# EAGLE design backplane rev 2 (EAGLE 9.6.2)
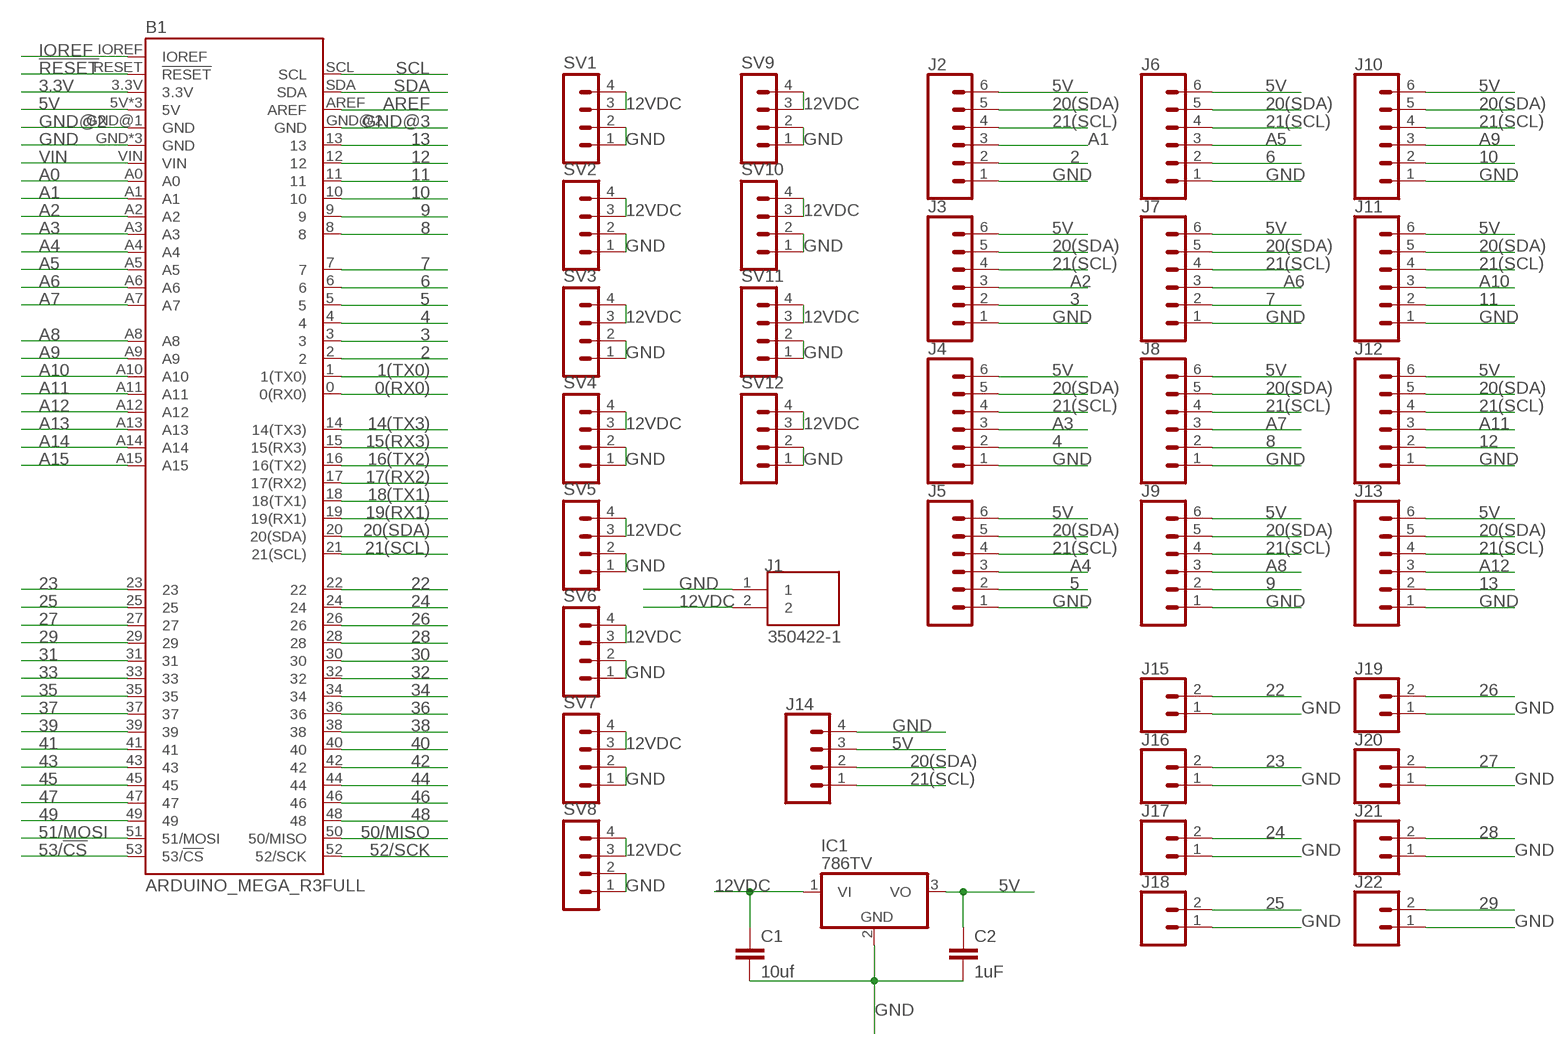
[diagram p0: schematic, sheet 1]

## Parts
B1  ARDUINO_MEGA_R3FULL  [ARDUINO_MEGA_NO_SILK]
C1  10uf  C2,5-3  [C2.5-3]
C2  1uF  C2,5-3  [C2.5-3]
IC1  786TV  [TO220V]
J1  350422-1  [POWER-PIN]
J2  CONN_06NO_SILK_FEMALE_PTH  [1X06_NO_SILK]
J3  CONN_06NO_SILK_FEMALE_PTH  [1X06_NO_SILK]
J4  CONN_06NO_SILK_FEMALE_PTH  [1X06_NO_SILK]
J5  CONN_06NO_SILK_FEMALE_PTH  [1X06_NO_SILK]
J6  CONN_06NO_SILK_FEMALE_PTH  [1X06_NO_SILK]
J7  CONN_06NO_SILK_FEMALE_PTH  [1X06_NO_SILK]
J8  CONN_06NO_SILK_FEMALE_PTH  [1X06_NO_SILK]
J9  CONN_06NO_SILK_FEMALE_PTH  [1X06_NO_SILK]
J10  CONN_06NO_SILK_FEMALE_PTH  [1X06_NO_SILK]
J11  CONN_06NO_SILK_FEMALE_PTH  [1X06_NO_SILK]
J12  CONN_06NO_SILK_FEMALE_PTH  [1X06_NO_SILK]
J13  CONN_06NO_SILK_FEMALE_PTH  [1X06_NO_SILK]
J14  CONN_04PTH  [1X04]
J15  CONN_02  [1X02]
J16  CONN_02  [1X02]
J17  CONN_02  [1X02]
J18  CONN_02  [1X02]
J19  CONN_02  [1X02]
J20  CONN_02  [1X02]
J21  CONN_02  [1X02]
J22  CONN_02  [1X02]
SV1  MA04-1  [MA04-1]
SV2  MA04-1  [MA04-1]
SV3  MA04-1  [MA04-1]
SV4  MA04-1  [MA04-1]
SV5  MA04-1  [MA04-1]
SV6  MA04-1  [MA04-1]
SV7  MA04-1  [MA04-1]
SV8  MA04-1  [MA04-1]
SV9  MA04-1  [MA04-1]
SV10  MA04-1  [MA04-1]
SV11  MA04-1  [MA04-1]
SV12  MA04-1  [MA04-1]

## Nets
0(RX0): B1.0(0(RX0))
1(TX0): B1.1(1(TX0))
2: B1.2 J2.2
3: B1.3 J3.2
3.3V: B1.3.3V
4: B1.4 J4.2
5: B1.5 J5.2
5V: B1.5V B1.5V@1(5V) B1.5V@2(5V) C2.1 IC1.3(VO) J2.6 J3.6 J4.6 J5.6 J6.6 J7.6 J8.6 J9.6 J10.6 J11.6 J12.6 J13.6 J14.3
6: B1.6 J6.2
7: B1.7 J7.2
8: B1.8 J8.2
9: B1.9 J9.2
10: B1.10 J10.2
11: B1.11 J11.2
12: B1.12 J12.2
12VDC: C1.1 IC1.1(VI) J1.2 SV1.3 SV1.4 SV2.3 SV2.4 SV3.3 SV3.4 SV4.3 SV4.4 SV5.3 SV5.4 SV6.3 SV6.4 SV7.3 SV7.4 SV8.3 SV8.4 SV9.3 SV9.4 SV10.3 SV10.4 SV11.3 SV11.4 SV12.3 SV12.4
13: B1.13 J13.2
14(TX3): B1.14(14(TX3))
15(RX3): B1.15(15(RX3))
16(TX2): B1.16(16(TX2))
17(RX2): B1.17(17(RX2))
18(TX1): B1.18(18(TX1))
19(RX1): B1.19(19(RX1))
20(SDA): B1.20(20(SDA)) J2.5 J3.5 J4.5 J5.5 J6.5 J7.5 J8.5 J9.5 J10.5 J11.5 J12.5 J13.5 J14.2
21(SCL): B1.21(21(SCL)) J2.4 J3.4 J4.4 J5.4 J6.4 J7.4 J8.4 J9.4 J10.4 J11.4 J12.4 J13.4 J14.1
22: B1.22 J15.2
23: B1.23 J16.2
24: B1.24 J17.2
25: B1.25 J18.2
26: B1.26 J19.2
27: B1.27 J20.2
28: B1.28 J21.2
29: B1.29 J22.2
30: B1.30
31: B1.31
32: B1.32
33: B1.33
34: B1.34
35: B1.35
36: B1.36
37: B1.37
38: B1.38
39: B1.39
40: B1.40
41: B1.41
42: B1.42
43: B1.43
44: B1.44
45: B1.45
46: B1.46
47: B1.47
48: B1.48
49: B1.49
50/MISO: B1.50(50/MISO)
51/MOSI: B1.51(51/MOSI)
52/SCK: B1.52(52/SCK)
53/!CS: B1.53(53/!CS)
!RESET: B1.RESET(!RESET)
A0: B1.A0
A1: B1.A1 J2.3
A2: B1.A2 J3.3
A3: B1.A3 J4.3
A4: B1.A4 J5.3
A5: B1.A5 J6.3
A6: B1.A6 J7.3
A7: B1.A7 J8.3
A8: B1.A8 J9.3
A9: B1.A9 J10.3
A10: B1.A10 J11.3
A11: B1.A11 J12.3
A12: B1.A12 J13.3
A13: B1.A13
A14: B1.A14
A15: B1.A15
AREF: B1.AREF
GND: B1.GND B1.GND@3(GND) B1.GND@4(GND) C1.2 C2.2 IC1.2(GND) J1.1 J2.1 J3.1 J4.1 J5.1 J6.1 J7.1 J8.1 J9.1 J10.1 J11.1 J12.1 J13.1 J14.4 J15.1 J16.1 J17.1 J18.1 J19.1 J20.1 J21.1 J22.1 SV1.1 SV1.2 SV2.1 SV2.2 SV3.1 SV3.2 SV4.1 SV4.2 SV5.1 SV5.2 SV6.1 SV6.2 SV7.1 SV7.2 SV8.1 SV8.2 SV9.1 SV9.2 SV10.1 SV10.2 SV11.1 SV11.2 SV12.1 SV12.2
GND@2: B1.GND@1(GND)
GND@3: B1.GND@2(GND)
IOREF: B1.IOREF
SCL: B1.SCL
SDA: B1.SDA
VIN: B1.VIN

## Library data of the parts
B1 = SparkFun-Boards:ARDUINO_MEGA_R3: Arduino Mega R3 ATmega2560 R3 compatible footprint. SparkFun Products: Arduino Mega 2560 R3 <https://www.sparkfun.com/products/11061>
C1 C2 = capacitor-wima:C: CAPACITOR naming: grid - package width
IC1 = linear:78*: Positive VOLTAGE REGULATOR Source: http://cache.national.com/ds/LM/LM78L05.pdf http://www.fairchildsemi.com/ds/LM/LM7805.pdf
J1 = 350422-1:350422-1; COMMENT: 350422-1; DESCRIPTION: 02P CMNL HDR ASSY PC NATL; DIGI-KEY_PART_NUMBER: A14367-ND; EU_ROHS_COMPLIANCE: Compliant; MF: TE Connectivity; MP: 350422-1; PACKAGE: None; PURCHASE-URL: https://pricing.snapeda.com/search/part/350422-1/?ref=eda
J2-J13 = SparkFun-Connectors:CONN_06: Multi connection point. Often used as Generic Header-pin footprint for 0.1 inch spaced/style header connections On any of the 0.1 inch spaced packages, you can populate with these: Break Away Headers - Straight <https://www.sparkfun.com/products/116> (PRT-00116) Break Away Male Headers - Right Angle <https://www.sparkfun.com/products/553> (PRT-00553) Female Headers <https://www.sparkfun.com/products/115> (PRT-00115) Break Away Headers - Machine Pin <https://www.sparkfun.com/products/117> (PRT-00117) Break Away Female Headers - Swiss Machine Pin <https://www.sparkfun.com/products/743> (PRT-00743) Arduino Stackable Header - 6 Pin <https://www.sparkfun.com/products/9280> (PRT-09280) For SCREWTERMINALS and SPRING TERMINALS visit here: Screw Terimnals on SparkFun.com <https://www.sparkfun.com/search/results?term=Screw+Terminals> (5mm/3.5mm/2.54mm spacing) This device is also useful as a general connection point to wire up your design to another part of your project. Our various solder wires solder well into these plated through hole pads. Hook-Up Wire - Assortment (Stranded, 22 AWG) <https://www.sparkfun.com/products/11375> (PRT-11375) Hook-Up Wire - Assortment (Solid Core, 22 AWG) <https://www.sparkfun.com/products/11367> (PRT-11367) View the entire wire category on our website here <https://www.sparkfun.com/categories/141>; PROD_ID: CONN-08437
J14 = SparkFun-Connectors:CONN_04: Multi connection point. Often used as Generic Header-pin footprint for 0.1 inch spaced/style header connections On any of the 0.1 inch spaced packages, you can populate with these: Break Away Headers - Straight <https://www.sparkfun.com/products/116> (PRT-00116) Break Away Male Headers - Right Angle <https://www.sparkfun.com/products/553> (PRT-00553) Female Headers <https://www.sparkfun.com/products/115> (PRT-00115) Break Away Headers - Machine Pin <https://www.sparkfun.com/products/117> (PRT-00117) Break Away Female Headers - Swiss Machine Pin <https://www.sparkfun.com/products/743> (PRT-00743) For SCREWTERMINALS and SPRING TERMINALS visit here: Screw Terimnals on SparkFun.com <https://www.sparkfun.com/search/results?term=Screw+Terminals> (5mm/3.5mm/2.54mm spacing) This device is also useful as a general connection point to wire up your design to another part of your project. Our various solder wires solder well into these plated through hole pads. Hook-Up Wire - Assortment (Stranded, 22 AWG) <https://www.sparkfun.com/products/11375> (PRT-11375) Hook-Up Wire - Assortment (Solid Core, 22 AWG) <https://www.sparkfun.com/products/11367> (PRT-11367) View the entire wire category on our website here <https://www.sparkfun.com/categories/141> Special notes: Molex polarized connector foot print use with SKU : PRT-08231 with associated crimp pins and housings. 1MM SMD Version SKU: PRT-10208; PROD_ID: CONN-09696
J15-J22 = SparkFun-Connectors:CONN_02: Multi connection point. Often used as Generic Header-pin footprint for 0.1 inch spaced/style header connections On any of the 0.1 inch spaced packages, you can populate with these: Break Away Headers - Straight <https://www.sparkfun.com/products/116> (PRT-00116) Break Away Male Headers - Right Angle <https://www.sparkfun.com/products/553> (PRT-00553) Female Headers <https://www.sparkfun.com/products/115> (PRT-00115) Break Away Headers - Machine Pin <https://www.sparkfun.com/products/117> (PRT-00117) Break Away Female Headers - Swiss Machine Pin <https://www.sparkfun.com/products/743> (PRT-00743) For SCREWTERMINALS and SPRING TERMINALS visit here: Screw Terimnals on SparkFun.com <https://www.sparkfun.com/search/results?term=Screw+Terminals> (5mm/3.5mm/2.54mm spacing) This device is also useful as a general connection point to wire up your design to another part of your project. Our various solder wires solder well into these plated through hole pads. Hook-Up Wire - Assortment (Stranded, 22 AWG) <https://www.sparkfun.com/products/11375> (PRT-11375) Hook-Up Wire - Assortment (Solid Core, 22 AWG) <https://www.sparkfun.com/products/11367> (PRT-11367) View the entire wire category on our website here <https://www.sparkfun.com/categories/141> Special notes: Molex polarized connector foot print use with: PRT-08233 with associated crimp pins and housings. 2.54_SCREWTERM for use with PRT-10571. 3.5mm Screw Terminal footprints for PRT-08084 5mm Screw Terminal footprints for use with PRT-08432
SV1-SV12 = con-lstb:MA04-1: PIN HEADER; OC_FARNELL: unknown; OC_NEWARK: unknown

## Board
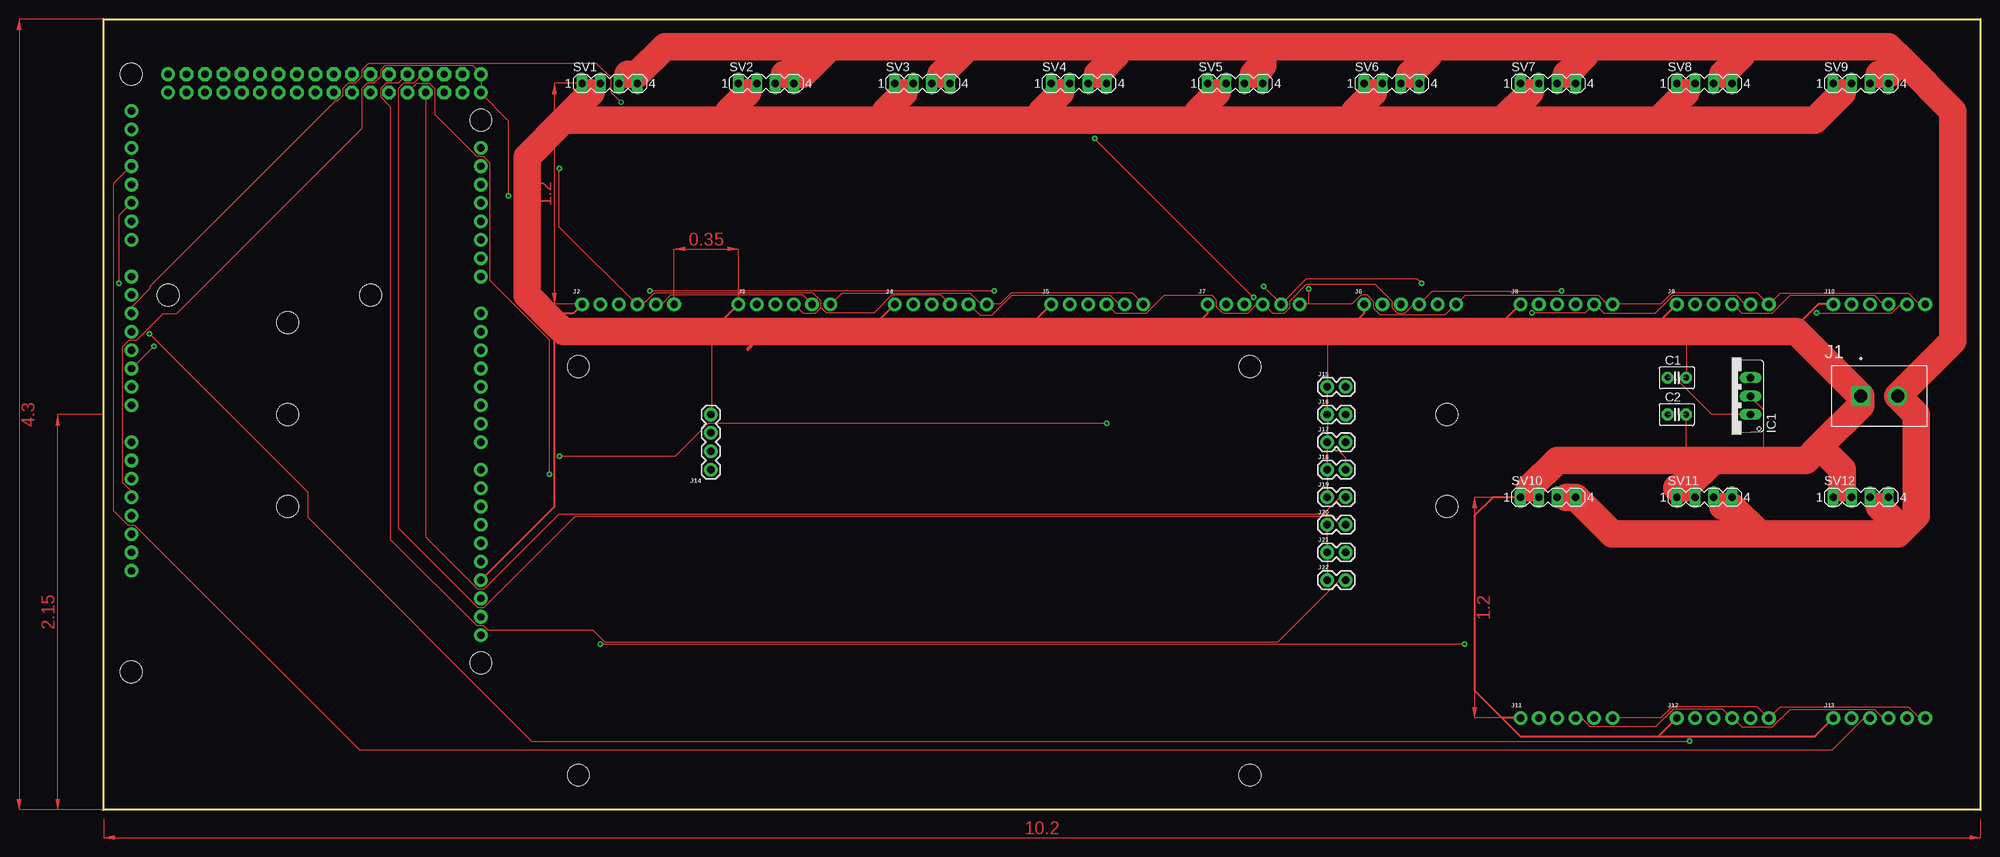
[diagram p1: board, top side]
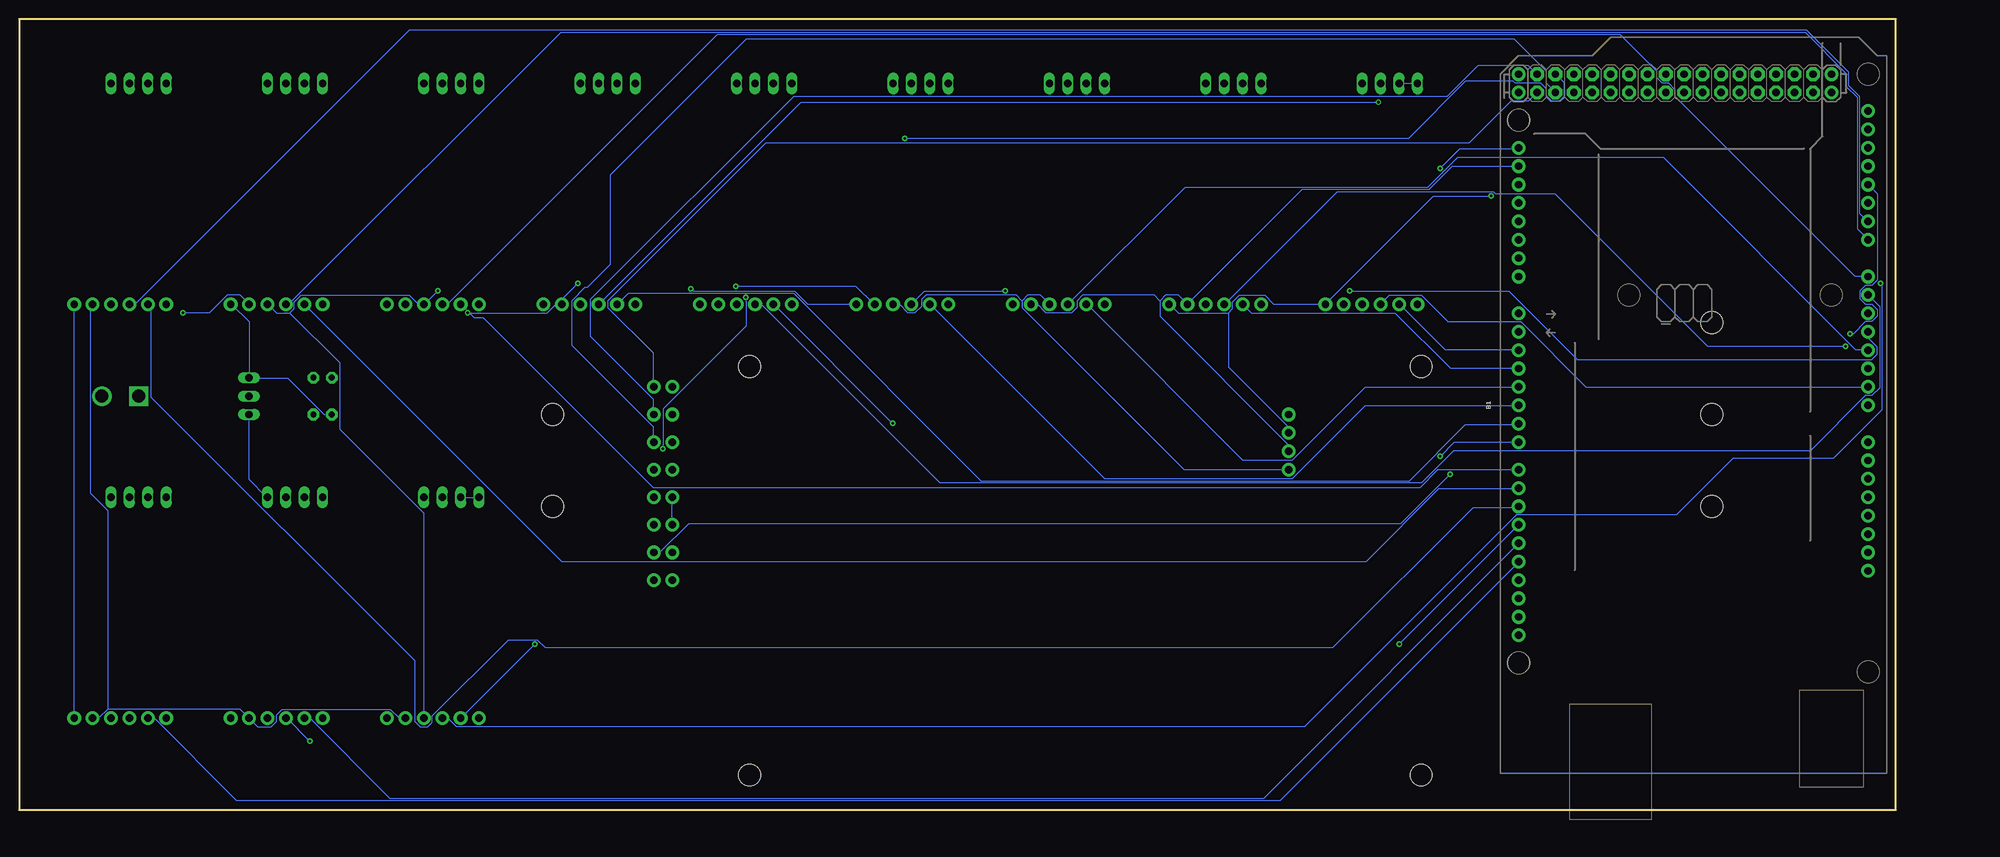
[diagram p2: board, bottom side, seen from below]

Size 259.08 x 109.22 mm. Coordinates in mm from the lower left corner, seen from the top.
Outline: 0,109.22 259.08,109.22 259.08,0 0,0 0,109.22
Copper layers (1*16): Top 0.035mm / dielectric 1.5mm / Bottom 0.035mm
Design rules "default": minimum track width 6mil, minimum drill 0.35mm, track to track 6mil, track to pad 6mil, pad to pad 6mil, via to via 6mil, smd to smd 6mil, copper to edge 40mil, drill to drill 6mil, minimum pad ring 10mil, minimum via ring 8mil, stop-mask expansion 4mil, vias tented up to drill 0mil, thermal gap 10mil
Holes 3.05 mm at 36.83,71.12 8.89,71.12 3.81,101.6 52.07,95.25 3.81,19.05 52.07,20.32 65.53,61.21 65.53,4.83 158.24,61.21 158.24,4.83 25.4,54.61 25.4,41.91 25.4,67.31 185.42,41.91 185.42,54.61

### Footprints (pad centres in the part's own frame; a part is rotated, then mirrored left to right if it is on the bottom)
ARDUINO_MEGA_NO_SILK = drill 1.016 pad 1.88: 0 13.97,24.13; 1 11.43,24.13; 2 8.89,24.13; 3 6.35,24.13; 3.3V -13.97,-24.13; 4 3.81,24.13; 5 1.27,24.13; 5V -11.43,-24.13; 5V@1 44.45,24.13; 5V@2 46.99,24.13; 6 -1.27,24.13; 7 -3.81,24.13; 8 -7.62,24.13; 9 -10.16,24.13; 10 -12.7,24.13; 11 -15.24,24.13; 12 -17.78,24.13; 13 -20.32,24.13; 14 19.05,24.13; 15 21.59,24.13; 16 24.13,24.13; 17 26.67,24.13; 18 29.21,24.13; 19 31.75,24.13; 20 34.29,24.13; 21 36.83,24.13; A0 1.27,-24.13; A1 3.81,-24.13; A2 6.35,-24.13; A3 8.89,-24.13; A4 11.43,-24.13; A5 13.97,-24.13; A6 16.51,-24.13; A7 19.05,-24.13; A8 24.13,-24.13; A9 26.67,-24.13; A10 29.21,-24.13; A11 31.75,-24.13; A12 34.29,-24.13; A13 36.83,-24.13; A14 39.37,-24.13; A15 41.91,-24.13; AREF -25.4,24.13; GND -8.89,-24.13; GND@1 -6.35,-24.13; GND@2 44.45,-19.05; GND@3 46.99,-19.05; GND@4 -22.86,24.13; IOREF -19.05,-24.13; NC -21.59,-24.13; RESET -16.51,-24.13; SCL -30.48,24.13; SDA -27.94,24.13; VIN -3.81,-24.13 | drill 1.016 pad 1.88 octagon: 22 44.45,21.59; 23 46.99,21.59; 24 44.45,19.05; 25 46.99,19.05; 26 44.45,16.51; 27 46.99,16.51; 28 44.45,13.97; 29 46.99,13.97; 30 44.45,11.43; 31 46.99,11.43; 32 44.45,8.89; 33 46.99,8.89; 34 44.45,6.35; 35 46.99,6.35; 36 44.45,3.81; 37 46.99,3.81; 38 44.45,1.27; 39 46.99,1.27; 40 44.45,-1.27; 41 46.99,-1.27; 42 44.45,-3.81; 43 46.99,-3.81; 44 44.45,-6.35; 45 46.99,-6.35; 46 44.45,-8.89; 47 46.99,-8.89; 48 44.45,-11.43; 49 46.99,-11.43; 50 44.45,-13.97; 51 46.99,-13.97; 52 44.45,-16.51; 53 46.99,-16.51
C2.5-3 = drill 0.813 pad 1.6 octagon: 1 -1.27,0; 2 1.27,0
TO220V = drill 1.016 long: 1 -2.54,-2.54; 2 0,-2.54; 3 2.54,-2.54
POWER-PIN = drill 1.778 square: 1 -2.54,0 | drill 1.778: 2 2.54,0
1X06_NO_SILK = drill 1.016 pad 1.88: 1 0,0; 2 2.54,0; 3 5.08,0; 4 7.62,0; 5 10.16,0; 6 12.7,0
1X04 = drill 1.016 pad 1.88: 1 0,0; 2 2.54,0; 3 5.08,0; 4 7.62,0
1X02 = drill 1.016 pad 1.88: 1 0,0; 2 2.54,0
MA04-1 = drill 1.016 long: 1 -3.81,0; 2 -1.27,0; 3 1.27,0; 4 3.81,0

### Placement (x,y rotation side)
B1  27.94,54.61 90 bottom
C1  217.17,59.69 0 top
C2  217.17,54.61 0 top
IC1  224.79,57.15 90 top
J1  245.11,57.15 0 top
J2  66.04,69.85 0 top
J3  87.63,69.85 0 top
J4  109.22,69.85 0 top
J5  130.81,69.85 0 top
J6  173.99,69.85 0 top
J7  152.4,69.85 0 top
J8  195.58,69.85 0 top
J9  217.17,69.85 0 top
J10  238.76,69.85 0 top
J11  195.58,12.7 0 top
J12  217.17,12.7 0 top
J13  238.76,12.7 0 top
J14  83.82,46.99 90 top
J15  168.91,58.42 0 top
J16  168.91,54.61 0 top
J17  168.91,50.8 0 top
J18  168.91,46.99 0 top
J19  168.91,43.18 0 top
J20  168.91,39.37 0 top
J21  168.91,35.56 0 top
J22  168.91,31.75 0 top
SV1  69.85,100.33 0 top
SV2  91.44,100.33 0 top
SV3  113.03,100.33 0 top
SV4  134.62,100.33 0 top
SV5  156.21,100.33 0 top
SV6  177.8,100.33 0 top
SV7  199.39,100.33 0 top
SV8  220.98,100.33 0 top
SV9  242.57,100.33 0 top
SV10  199.39,43.18 0 top
SV11  220.98,43.18 0 top
SV12  242.57,43.18 0 top

### Tracks (layer width: path | path; a pad name or v marks a point on that pad's centre or on a via)
2
  Bottom 0.152: B1.2 52.07,63.6 62.28,63.6 68.53,69.85 J2.2
3
  Bottom 0.152: J3.2 88.95,68.63 69.14,68.63 61.52,61.01 52.07,61.01 B1.3
4
  Bottom 0.152: B1.4 73.25,58.42 83.31,48.36 90.17,48.36 111.66,69.85 J4.2
5
  Bottom 0.152: B1.5 52.07,55.83 73.25,55.83 83.31,45.77 109.22,45.77 133.3,69.85 J5.2
5V  (via drill 0.35)
  Top 0.152: B1.5V 3.76,43.18 3.76,44.09 2.54,45.31 2.54,63.91 3.45,64.82 4.52,64.82 8.18,68.48 10.01,68.48 35.61,94.08 35.61,99.57 36.37,100.33 37.29,100.33 38.2,101.24 38.2,102.16 38.81,102.77 51,102.77 52.07,101.7 B1.5V@2 B1.5V@1 52.07,98.96 55.88,95.15 v55.88,84.78 | J5.6 141.99,71.37 125.22,71.37 123.7,69.85 J4.6 121.11,69.85 119.58,71.37 101.91,71.37 100.38,69.85 J3.6 | 166.37,69.85 172.31,69.85 173.53,71.07 174.45,71.07 175.36,70.16 175.36,69.24 176.28,68.33 185.12,68.33 186.64,69.85 J6.6 186.79,69.85 188.01,71.07 206.3,71.07 207.52,69.85 J8.6 214.99,69.85 216.51,71.37 228.24,71.37 229.77,69.85 J9.6 229.92,69.85 231.45,71.37 249.12,71.37 250.65,69.85 J10.6 | 166.37,69.85 J7.6 | J11.6 214.99,12.7 216.51,14.22 228.24,14.22 229.77,12.7 J12.6 229.92,12.7 231.45,14.22 249.12,14.22 250.65,12.7 J13.6 | 166.37,69.85 v166.37,71.98
  Bottom 0.152: 92.15,68.63 91.54,69.24 91.54,70.16 90.63,71.07 87.12,71.07 85.9,69.85 J2.6 63.8,84.78 v55.88,84.78 | 92.15,68.63 99.01,68.63 100.23,69.85 J3.6 | 92.15,68.63 92.15,61.16 83.92,52.93 83.92,52.17 J14.3 | J9.6 229.77,69.85 227.33,67.41 IC1.3 227.33,59.64 222,59.64 216.97,54.61 C2.1 | J13.6 251.56,12.7 251.56,69.85 J10.6 | J5.6 150.22,69.85 152.04,71.68 166.06,71.68 v166.37,71.98
6
  Bottom 0.152: B1.6 52.07,53.24 59.38,53.24 67.16,45.47 126.29,45.47 152.2,71.37 174.9,71.37 176.43,69.85 J6.2
7  (via drill 0.35)
  Top 0.152: v62.89,48.82 78.89,48.82 83.46,53.39 v138.48,53.39
  Bottom 0.152: B1.7 60.91,50.8 v62.89,48.82 | J7.2 v138.48,53.39
8
  Bottom 0.152: B1.8 63.19,46.99 65.63,44.55 171.55,44.55 195.02,68.02 196.29,68.02 J8.2
9
  Bottom 0.152: J9.2 184.2,34.34 73.1,34.34 63.04,44.4 52.07,44.4 B1.9
10
  Bottom 0.152: B1.10 52.07,41.81 58.32,41.81 77.67,22.45 186.49,22.45 187.55,23.52 191.52,23.52 202.03,13 202.03,12.09 202.64,11.48 203.71,11.48 204.47,12.24 204.47,20.62 240.89,57.05 240.89,69.54 241.2,69.85 J10.2
11  (via drill 0.35)
  Top 0.152: v68.53,22.91 v187.86,22.91
  Bottom 0.152: v187.86,22.91 198.07,12.7 J11.2 | B1.11 v68.53,22.91
12
  Bottom 0.152: J12.2 218.95,12.7 207.82,1.58 87.27,1.58 52.07,36.78 B1.12
12VDC
  Top 0.152: SV1.3 72.39,101.6 | SV12.4 245.11,41.91 243.94,43.18 SV12.3 | SV1.4 73.71,100.33 73.66,101.6 | SV2.3 92.76,100.33 93.98,101.6 | SV2.4 95.35,100.33 96.52,101.6 | SV3.3 114.4,100.33 115.57,101.6 SV3.4 | SV4.3 137.16,101.6 | SV4.4 138.48,100.33 137.19,101.62 | SV10.3 201.93,43.18 | SV5.3 157.53,100.33 158.75,101.6 | SV5.4 160.12,100.33 158.8,101.65 | SV11.3 222.3,43.18 223.52,41.91 | SV11.4 224.89,43.18 224.79,41.91 | SV6.3 179.17,100.33 180.34,101.6 SV6.4 | SV7.3 201.93,101.6 | SV7.4 203.25,100.33 201.96,101.62 | SV8.3 222.3,100.33 223.52,101.6 | SV8.4 224.89,100.33 223.57,101.65 | SV9.3 243.94,100.33 245.11,101.6 | SV9.4 246.38,101.6 | IC1.1 222,54.61 216.97,59.64 215.9,59.64 C1.1
  Top 3.81: 248.29,103.5 255.27,96.52 255.27,64.77 J1.2 250.19,54.61 250.19,40.64 247.65,38.1 | 248.29,103.5 246.38,105.41 226.06,105.41 | 72.39,101.6 73.66,101.6 77.47,105.41 100.33,105.41 | 226.06,105.41 204.47,105.41 | 204.47,105.41 182.88,105.41 | 182.88,105.41 160.02,105.41 | 139.7,105.41 160.02,105.41 | 139.7,105.41 119.38,105.41 | 119.38,105.41 100.33,105.41 | 100.33,105.41 96.52,101.6 93.98,101.6 | 119.38,105.41 115.57,101.6 | 139.7,105.41 139.7,104.14 137.19,101.62 137.16,101.6 | 160.02,105.41 160.02,102.87 158.8,101.65 158.75,101.6 | 182.88,105.41 182.88,104.14 180.34,101.6 | 204.47,105.41 204.47,104.14 201.96,101.62 201.93,101.6 | 226.06,105.41 226.06,104.14 223.57,101.65 223.52,101.6 | 248.29,103.5 246.38,101.6 245.11,101.6 | 228.6,38.1 247.65,38.1 | 228.6,38.1 208.28,38.1 SV10.4 201.93,43.18 | 228.6,38.1 224.79,41.91 223.52,41.91 | 247.65,38.1 247.65,39.37 245.11,41.91
  Bottom 0.152: IC1.1 227.33,45.62 224.89,43.18 SV11.4
13
  Bottom 0.152: J13.2 240.44,12.7 229.01,1.27 84.99,1.27 52.07,34.19 B1.13
20(SDA)  (via drill 0.35)
  Top 0.152: v197.16,68.63 204.47,68.63 205.69,69.85 J8.5 205.84,69.85 207.06,68.63 214.22,68.63 216.66,71.07 225.35,71.07 226.57,69.85 J9.5 | J10.5 248.06,69.85 246.84,68.63 v236.47,68.63 | J2.5 77.06,69.85 78.28,71.07 96.57,71.07 J3.5 | J5.5 140.16,69.85 138.94,71.07 125.37,71.07 122.63,68.33 120.95,68.33 119.43,69.85 J4.5 | v160.12,72.29 J7.5 166.06,73.35 181.31,73.35 v181.92,72.75
  Bottom 0.152: J11.5 206.6,12.7 207.82,13.92 222.76,13.92 223.52,13.16 223.52,12.24 224.28,11.48 226.11,11.48 J12.5 228.55,13.92 246.84,13.92 | J13.5 248.06,12.7 246.84,13.92 | v197.16,68.63 186.18,68.63 184.96,69.85 J6.5 184.05,69.85 184.05,70.61 v181.92,72.75 | v236.47,68.63 232.82,68.63 230.38,71.07 228.55,71.07 J9.5 | 246.84,13.92 246.84,41.35 249.28,43.79 249.28,69.54 248.97,69.85 J10.5 | 101.6,70.31 101.6,68.17 83.92,50.49 83.92,49.58 J14.2 | 101.6,70.31 100.84,71.07 99.01,71.07 J3.5 81.94,85.7 64.41,85.7 61.21,88.9 B1.20 | J4.5 118.52,69.85 117.3,68.63 113.79,68.63 113.03,69.39 113.03,70.31 112.27,71.07 102.36,71.07 101.6,70.31 | v160.12,72.29 143.51,72.29 141.07,69.85 J5.5
21(SCL)  (via drill 0.35)
  Top 0.152: J11.4 204.01,12.7 205.23,11.48 214.22,11.48 216.66,13.92 223.52,13.92 224.74,12.7 J12.4 224.89,12.7 226.11,11.48 230.38,11.48 232.82,13.92 244.4,13.92 245.62,12.7 J13.4 | J10.4 245.62,69.85 244.4,71.07 232.82,71.07 230.38,68.63 226.11,68.63 224.89,69.85 J9.4 | 99.01,69.39 99.01,70.31 97.94,71.37 76,71.37 74.47,69.85 J2.4 73.56,69.85 62.89,80.52 v62.89,88.59 | 99.01,69.39 98.25,68.63 96.57,68.63 95.35,69.85 J3.4 | J5.4 138.48,69.85 139.7,68.63 143.97,68.63 146.41,71.07 152.96,71.07 153.57,70.46 153.57,69.54 154.48,68.63 157.99,68.63 159.21,69.85 J7.4 160.12,69.85 161.34,68.63 163.02,68.63 163.78,69.39 163.78,70.31 166.06,72.59 175.51,72.59 177.8,70.31 177.8,69.39 178.56,68.63 179.63,68.63 180.85,69.85 J6.4 183.44,71.68 v201.27,71.68 | 99.01,69.39 99.77,68.63 106.32,68.63 108.76,71.07 115.62,71.07 J4.4
  Bottom 0.152: 221.69,68.63 221.08,69.24 221.08,70.16 220.17,71.07 205.23,71.07 204.01,69.85 J8.4 203.1,69.85 v201.27,71.68 | 221.69,68.63 223.52,68.63 224.74,69.85 J9.4 | 221.69,68.63 214.83,61.77 214.83,52.63 203.25,41.05 203.25,12.7 J11.4 | v62.89,88.59 60.15,91.34 52.07,91.34 B1.21 | J14.1 98.25,46.99 120.65,69.39 120.65,70.31 | 120.65,70.31 119.89,71.07 118.06,71.07 J4.4 | J5.4 137.57,69.85 136.35,68.63 135.43,68.63 134.52,69.54 134.52,70.46 133.91,71.07 121.41,71.07 120.65,70.31
22
  Bottom 0.152: B1.22 50.7,97.89 53.14,97.89 58.93,92.1 156.01,92.1 177.8,70.31 177.8,69.39 171.55,63.14 171.55,58.42 J15.2
23
  Bottom 0.152: B1.23 50.7,102.77 57.71,102.77 61.98,98.5 152.2,98.5 180.24,70.46 180.24,65.43 171.55,56.74 171.55,54.61 J16.2
24
  Bottom 0.152: B1.24 48.26,100.33 48.26,102.01 52.68,106.43 158.75,106.43 177.5,87.68 177.5,75.34 180.7,72.14 181,72.14 182.83,70.31 182.83,64.21 171.55,52.93 171.55,50.8 J17.2
25  (via drill 0.35)
  Top 0.152: v170.18,49.89 171.4,48.67 171.4,46.99 J18.2 | v136.8,92.71 v158.75,70.76
  Bottom 0.152: v170.18,49.89 170.18,55.37 158.75,66.8 v158.75,70.76 | v136.8,92.71 67.31,92.71 59.38,100.63 52.83,100.63 52.53,100.33 49.02,100.33 48.26,99.57 48.26,98.65 47.5,97.89 46.43,97.89 45.82,98.5 45.82,100.48 46.89,101.55 B1.25
26
  Top 0.152: J19.2 170.64,43.18 168.35,40.89 62.89,40.89 52.53,30.53 51.61,30.53 44.45,37.69 B1.26
27
  Top 0.152: J20.2 170.64,39.37 169.42,40.59 65.18,40.59 52.53,27.94 51.61,27.94 40.64,38.91 40.64,99.57 41.4,100.33 42.77,100.33 43.99,101.55 44.45,101.55 B1.27
28  (via drill 0.35)
  Top 0.152: v61.52,46.38 61.52,64.97 53.29,73.2 53.29,89.36 52.38,90.27 51.46,90.27 45.67,96.06 45.67,99.57 44.91,100.33 43.23,100.33 42.01,99.11 B1.28
  Bottom 0.152: J21.2 170.64,35.56 166.68,39.52 68.38,39.52 v61.52,46.38
29
  Top 0.152: J22.2 170.64,31.75 162.1,23.22 69.14,23.22 67.46,24.89 52.98,24.89 52.38,25.5 51.46,25.5 39.57,37.39 39.57,97.13 38.2,98.5 38.2,99.57 38.96,100.33 40.64,100.33 B1.29
A1
  Bottom 0.152: B1.A1 42.77,58.42 51.77,67.41 61.82,67.41 65.48,71.07 69.9,71.07 J2.3
A2  (via drill 0.35)
  Top 0.152: v6.96,64.06 3.91,61.01 B1.A2
  Bottom 0.152: v6.96,64.06 26.01,64.06 47.04,85.09 55.27,85.09 55.57,85.39 77.06,85.39 92.61,69.85 J3.3
A3
  Bottom 0.152: B1.A3 3.91,63.6 5.59,63.6 32.11,90.12 60.45,90.12 64.57,86 98.09,86 114.25,69.85 J4.3
A4  (via drill 0.35)
  Top 0.152: v122.94,71.68 v75.39,71.68
  Bottom 0.152: v75.39,71.68 53.44,71.68 43.99,62.23 3.3,62.23 2.54,62.99 2.54,63.91 3.76,65.13 3.76,66.04 B1.A4 | v122.94,71.68 134.06,71.68 J5.3
A5  (via drill 0.35)
  Top 0.152: v71.42,97.74 70.05,99.11 70.05,101.09 68.07,103.07 36.52,103.07 35.61,102.16 35.61,101.24 34.7,100.33 33.78,100.33 33.02,99.57 33.02,98.65 32.26,97.89 31.95,97.89 6.35,72.29 6.35,71.98 3.91,69.54 3.91,68.63 B1.A5
  Bottom 0.152: v71.42,97.74 151.13,97.74 179.02,69.85 J6.3
A6
  Bottom 0.152: J7.3 156.62,69.85 131.93,45.16 65.48,45.16 61.06,49.58 11.84,49.58 4.22,57.2 3.3,57.2 2.23,58.27 2.23,69.54 B1.A6
A7
  Bottom 0.152: J8.3 199.9,69.85 162.71,107.04 38.05,107.04 33.02,102.01 33.02,101.09 32.26,100.33 31.34,100.33 30.43,99.42 30.43,98.5 5.59,73.66 B1.A7
A8
  Bottom 0.152: J9.3 221.84,69.85 184.35,107.34 12.45,107.34 6.81,101.7 6.81,99.87 5.28,98.35 5.28,80.21 B1.A8
A9
  Bottom 0.152: J10.3 243.03,69.85 205.23,107.64 12.29,107.64 6.5,101.85 6.5,100.02 4.98,98.5 4.98,82.35 3.91,81.28 B1.A9
A10  (via drill 0.35)
  Top 0.152: v2.08,72.75 2.08,82.04 3.76,83.72 B1.A10
  Bottom 0.152: J11.3 199.9,12.7 198.68,11.48 81.64,11.48 52.38,40.74 30.28,40.74 22.5,48.51 8.64,48.51 1.93,55.22 1.93,72.59 v2.08,72.75
A11  (via drill 0.35)
  Top 0.152: v218.95,9.5 59.08,9.5 28.14,40.44 28.14,43.94 v6.35,65.73
  Bottom 0.152: v218.95,9.5 222.15,12.7 J12.3 | v6.35,65.73 5.89,65.73 4.22,67.41 3.3,67.41 2.54,68.17 2.54,69.09 3.3,69.85 4.22,69.85 4.98,70.61 4.98,71.68 4.22,72.44 3.3,72.44 2.54,73.2 2.54,85.09 B1.A11
A12
  Top 0.152: J13.3 243.03,12.7 238.61,8.28 35.31,8.28 4.22,39.37 3.3,39.37 1.32,41.35 1.32,86.46 3.76,88.9 B1.A12
GND
  Top 0.152: 168.96,54.61 168.96,50.8 | 168.96,54.61 168.96,58.42 | 168.96,54.61 J16.1 | 168.96,46.99 168.96,43.18 J19.1 | 168.96,35.56 168.96,31.75 J22.1 | 168.96,35.56 168.96,39.37 J20.1 | 168.96,35.56 J21.1 | 168.96,46.99 168.96,50.8 | 168.96,50.8 J17.1 | 168.96,46.99 J18.1 | SV2.1 87.73,100.33 88.9,99.06 SV2.2 | 63.12,66.42 62.28,65.58 62.23,65.58 | SV3.1 110.49,99.06 111.81,100.33 SV3.2 | SV4.1 130.86,100.33 132.08,99.06 133.45,100.33 SV4.2 | SV10.2 198.22,43.18 196.9,44.5 | SV5.1 152.5,100.33 153.67,99.06 SV5.2 | SV11.1 217.27,43.18 218.44,44.45 SV11.2 | SV6.1 175.26,99.06 176.58,100.33 SV6.2 | SV12.1 240.03,44.45 241.35,43.18 SV12.2 | 229.16,48.26 229.16,55.22 227.33,57.05 IC1.2 | SV7.1 195.63,100.33 196.85,99.06 198.22,100.33 SV7.2 | SV8.1 217.27,100.33 218.44,99.06 SV8.2 | SV9.1 240.03,99.06 241.35,100.33 SV9.2 | 218.49,48.26 218.49,54.61 C2.2 | 218.49,66.04 218.49,59.79 C1.2 | 83.92,66.04 83.92,54.61 J14.4 | 63.5,68.58 63.5,68.63 62.2,67.33 | SV1.2 68.68,100.33 67.31,99.06 | 150.5,66.67 150.52,66.65 150.52,66.04 | 172.11,66.7 172.16,66.65 172.16,66.04 | 85.24,67.46 85.29,67.41 85.29,66.04 | 128.4,67.44 128.42,67.41 128.42,66.04 | 214.78,67.46 214.83,67.41 214.83,66.04 | 103.58,64.77 103.58,66.04 | 189.99,64.77 189.99,66.04 | 168.96,66.04 168.96,58.42 | 168.96,58.42 J15.1
  Top 0.254: J2.1 64.77,68.58 63.5,68.58 | J3.1 85.24,67.46 82.55,64.77 | J4.1 104.14,64.77 103.58,64.77 102.87,64.77 | J5.1 128.4,67.44 125.73,64.77 | J7.1 152.4,68.58 150.5,66.67 148.59,64.77 | J6.1 173.99,68.58 172.11,66.7 170.18,64.77 | J8.1 190.5,64.77 189.99,64.77 189.23,64.77 | J9.1 214.78,67.46 212.09,64.77 | J10.1 236.73,69.85 232.92,66.04 | B1.GND@4 62.23,41.91 62.23,65.58 62.23,66.04 | SV10.1 191.77,43.18 189.23,40.64 189.23,16.51 193.04,12.7 | J13.1 236.22,10.16 214.63,10.16 | 193.04,12.7 195.58,10.16 214.63,10.16 | J12.1 214.63,10.16 | J11.1 193.04,12.7 | 89.41,64.26 88.9,63.75 88.9,63.5 89.41,64.01 89.41,64.26 | 89.41,66.04 89.41,64.26
  Top 3.81: 63.5,95.25 58.42,90.17 58.42,71.12 62.2,67.33 63.12,66.42 63.5,66.04 83.92,66.04 85.29,66.04 89.41,66.04 103.58,66.04 128.42,66.04 150.52,66.04 168.96,66.04 172.16,66.04 189.99,66.04 214.83,66.04 218.49,66.04 232.92,66.04 233.68,66.04 J1.1 242.57,55.88 236.86,50.16 | 63.5,95.25 86.36,95.25 | 86.36,95.25 107.95,95.25 | 107.95,95.25 129.54,95.25 | 129.54,95.25 151.13,95.25 | 151.13,95.25 172.72,95.25 | 172.72,95.25 193.04,95.25 | 193.04,95.25 214.63,95.25 | 214.63,95.25 236.22,95.25 240.03,99.06 | 214.63,95.25 218.44,99.06 | 193.04,95.25 196.85,99.06 | 172.72,95.25 172.72,96.52 175.26,99.06 | 151.13,95.25 151.13,96.52 153.67,99.06 | 129.54,95.25 129.54,96.52 132.08,99.06 | 107.95,95.25 107.95,96.52 110.49,99.06 | 86.36,95.25 86.36,96.52 88.9,99.06 | 63.5,95.25 67.31,99.06 | 196.85,44.45 196.9,44.5 200.66,48.26 218.49,48.26 222.25,48.26 | 236.86,50.16 234.95,48.26 229.16,48.26 222.25,48.26 | 222.25,48.26 218.44,44.45 217.17,44.45 | 236.86,50.16 240.03,46.99 240.03,44.45
  Bottom 0.152: J19.1 168.96,43.18 168.96,39.37 J20.1 | SV1.2 SV1.1 | SV10.2 SV10.1
(copper drawn outside any net)
  shapes: Top area x6

### Text on the board
tValues: SLOT 1 | SLOT 2 | SLOT 3 | SLOT 4 | SLOT 5 | SLOT 6 | SLOT 7 | SLOT 8 | SLOT 9 | D1 | GND | D2 | VCC | D3 | SDA | SDL | D4 | SLOT 10 | SLOT 11 | SLOT 12 | D5 | D6 | D7 | D8